# EAGLE schematic reflow-oven (EAGLE 9.6.2)
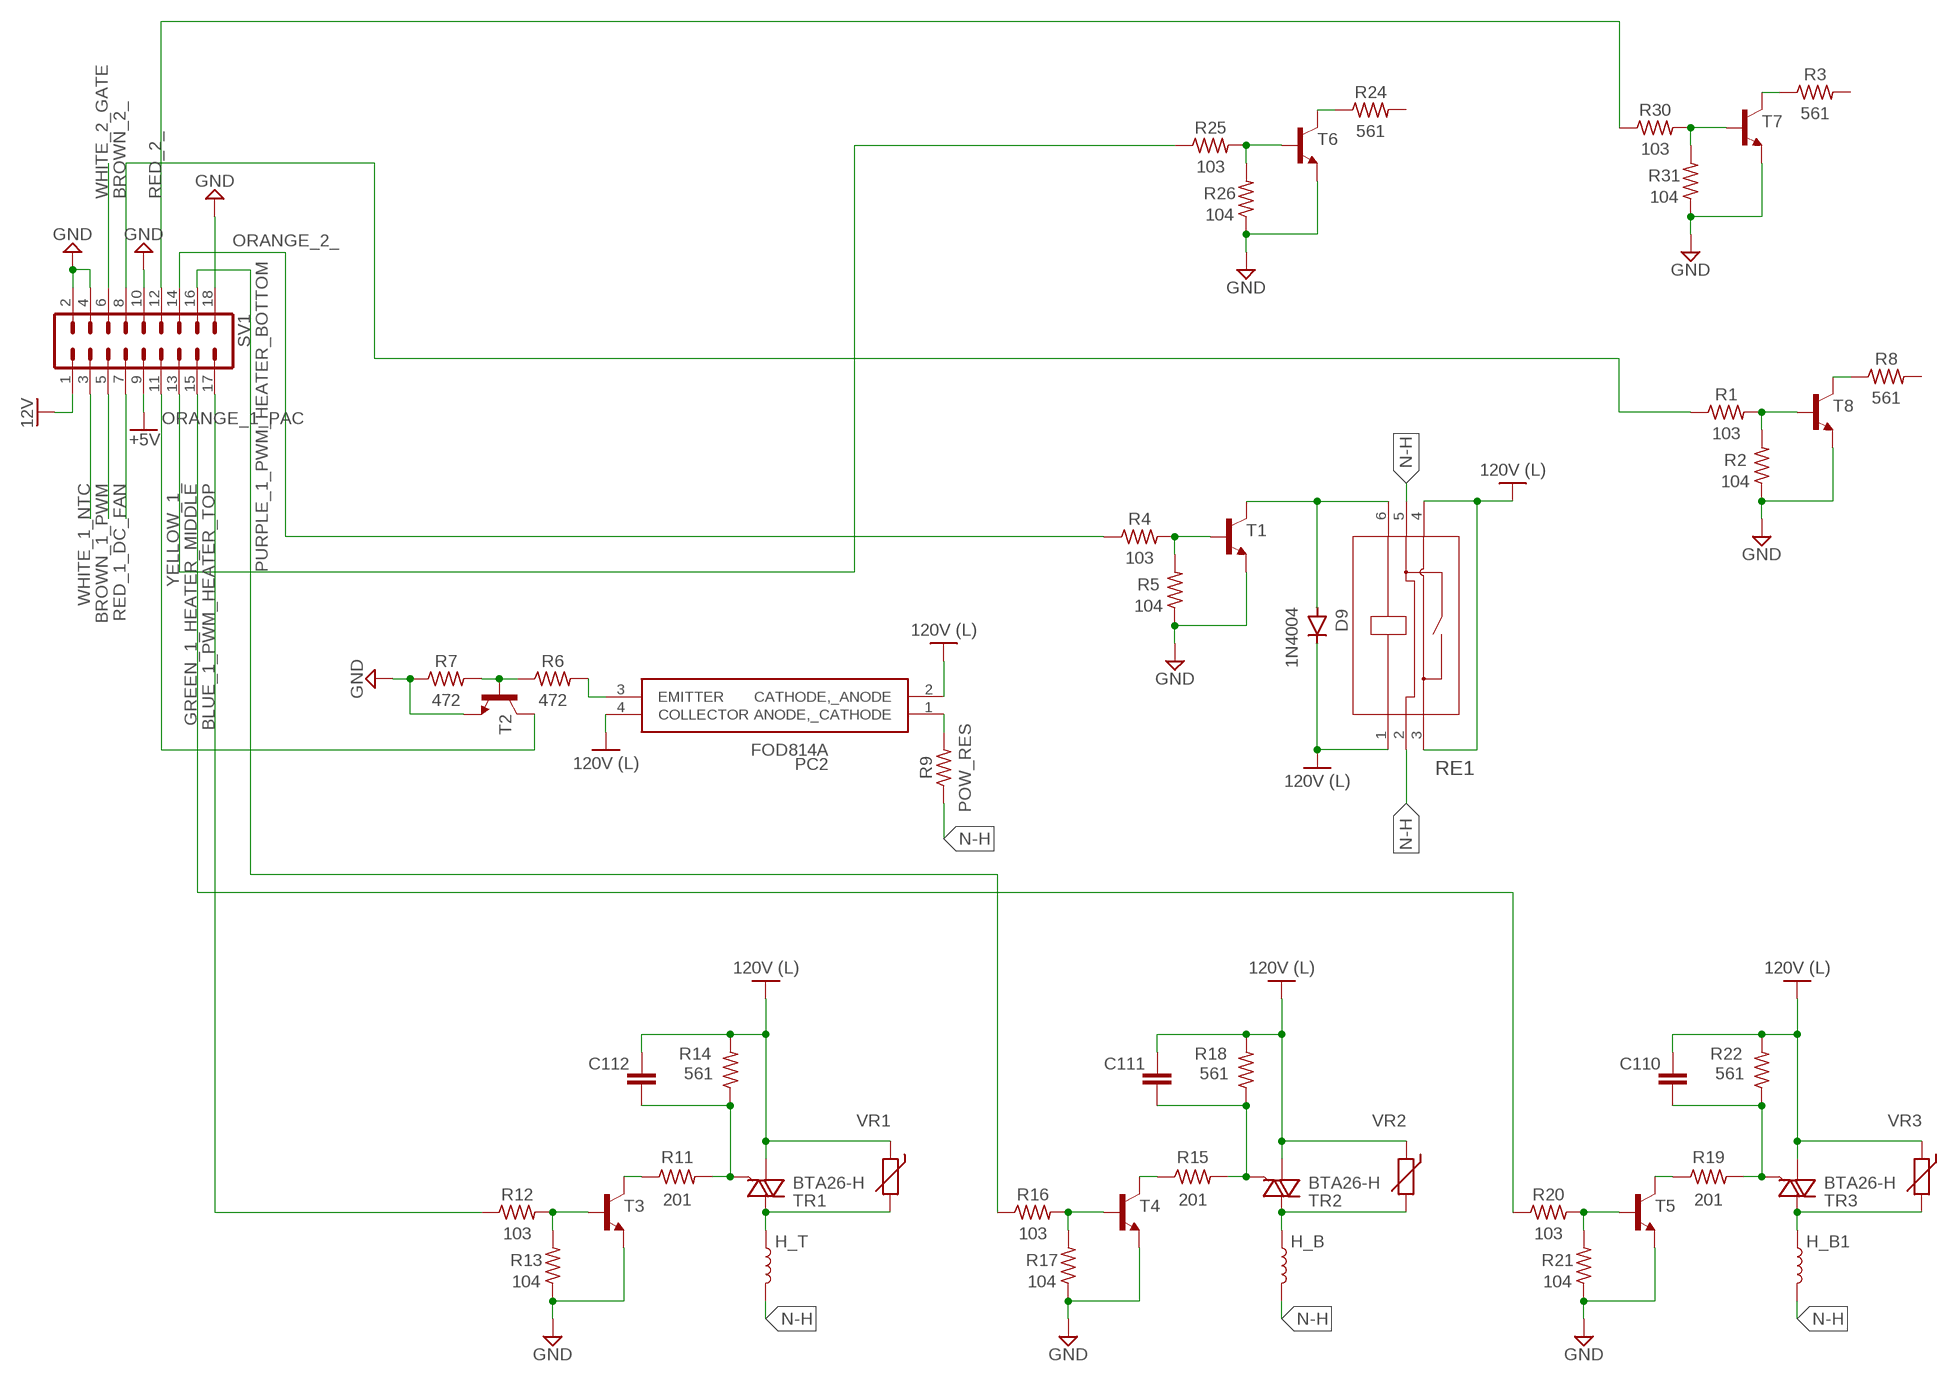
[diagram p0: schematic, sheet 1]

## Parts
C110  C_CHIP-1206(3216-METRIC)  [CAPC3216X135]
C111  C_CHIP-1206(3216-METRIC)  [CAPC3216X135]
C112  C_CHIP-1206(3216-METRIC)  [CAPC3216X135]
D9  1N4004  [DO-41]
H_B  3.9NH  INDUCTOR-0402-3.9NH  [0402]
H_B1  3.9NH  INDUCTOR-0402-3.9NH  [0402]
H_T  3.9NH  INDUCTOR-0402-3.9NH  [0402]
PC2  FOD814A  [DIP762W60P254L460H440Q4N]
R1  103  R-US_CHIP-1206(3216-METRIC)  [RESC3216X70]
R2  104  R-US_CHIP-1206(3216-METRIC)  [RESC3216X70]
R3  561  R-US_CHIP-1206(3216-METRIC)  [RESC3216X70]
R4  103  R-US_CHIP-1206(3216-METRIC)  [RESC3216X70]
R5  104  R-US_CHIP-1206(3216-METRIC)  [RESC3216X70]
R6  472  R-US_CHIP-1206(3216-METRIC)  [RESC3216X70]
R7  472  R-US_CHIP-1206(3216-METRIC)  [RESC3216X70]
R8  561  R-US_CHIP-1206(3216-METRIC)  [RESC3216X70]
R9  POW_RES  R-US_CHIP-1206(3216-METRIC)  [RESC3216X70]
R11  201  R-US_CHIP-1206(3216-METRIC)  [RESC3216X70]
R12  103  R-US_CHIP-1206(3216-METRIC)  [RESC3216X70]
R13  104  R-US_CHIP-1206(3216-METRIC)  [RESC3216X70]
R14  561  R-US_CHIP-1206(3216-METRIC)  [RESC3216X70]
R15  201  R-US_CHIP-1206(3216-METRIC)  [RESC3216X70]
R16  103  R-US_CHIP-1206(3216-METRIC)  [RESC3216X70]
R17  104  R-US_CHIP-1206(3216-METRIC)  [RESC3216X70]
R18  561  R-US_CHIP-1206(3216-METRIC)  [RESC3216X70]
R19  201  R-US_CHIP-1206(3216-METRIC)  [RESC3216X70]
R20  103  R-US_CHIP-1206(3216-METRIC)  [RESC3216X70]
R21  104  R-US_CHIP-1206(3216-METRIC)  [RESC3216X70]
R22  561  R-US_CHIP-1206(3216-METRIC)  [RESC3216X70]
R24  561  R-US_CHIP-1206(3216-METRIC)  [RESC3216X70]
R25  103  R-US_CHIP-1206(3216-METRIC)  [RESC3216X70]
R26  104  R-US_CHIP-1206(3216-METRIC)  [RESC3216X70]
R30  103  R-US_CHIP-1206(3216-METRIC)  [RESC3216X70]
R31  104  R-US_CHIP-1206(3216-METRIC)  [RESC3216X70]
RE1  HF115F/012-1HS3AF(257)HF115F-1H-3_HNG  [HF115F-1H-3_HNG]
SV1  MA09-2  [MA09-2]
T1  BC817-16LT1SMD  [SOT23-BEC]
T2  BC817-16LT1SMD  [SOT23-BEC]
T3  BC817-16LT1SMD  [SOT23-BEC]
T4  BC817-16LT1SMD  [SOT23-BEC]
T5  BC817-16LT1SMD  [SOT23-BEC]
T6  BC817-16LT1SMD  [SOT23-BEC]
T7  BC817-16LT1SMD  [SOT23-BEC]
T8  BC817-16LT1SMD  [SOT23-BEC]
TR1  BTA26-H  [TOP3L-1]
TR2  BTA26-H  [TOP3L-1]
TR3  BTA26-H  [TOP3L-1]
VR1  THERMISTOR-5  [R-5]
VR2  THERMISTOR-5  [R-5]
VR3  THERMISTOR-5  [R-5]

## Nets
12V: SV1.1
+5V: SV1.9
BLUE_1_PWM_HEATER_TOP: R12.1 SV1.17
BROWN_1_PWM: SV1.5
BROWN_2_: R1.1 SV1.8
GND: R2.1 R5.1 R7.1 R13.1 R17.1 R21.1 R26.1 R31.1 SV1.2 SV1.4 SV1.10 SV1.18 T1.E T2.E T3.E T4.E T5.E T6.E T7.E T8.E
GREEN_1_HEATER_MIDDLE: R20.1 SV1.15
N$1: R12.2 R13.2 T3.B
N$2: R20.2 R21.2 T5.B
N$3: R11.1 T3.C
N$4: H_T.1 TR1.A2 VR1.2
N$5: C112.2 R11.2 R14.1 TR1.G
N$6: R19.1 T5.C
N$7: R16.2 R17.2 T4.B
N$8: R15.1 T4.C
N$9: H_B.1 TR2.A2 VR2.2
N$10: C111.2 R15.2 R18.1 TR2.G
N$11: H_B1.1 TR3.A2 VR3.2
N$12: C110.2 R19.2 R22.1 TR3.G
N$13: PC2.1(ANODE,_CATHODE) R9.2
N$14: R25.2 R26.2 T6.B
N$15: R6.1 R7.2 T2.B
N$16: PC2.3(EMITTER) R6.2
N$17: R4.2 R5.2 T1.B
N$18: D9.A RE1.6 T1.C
N$19: R24.1 T6.C
N$20: R30.2 R31.2 T7.B
N$21: R3.1 T7.C
N$22: R1.2 R2.2 T8.B
N$23: R8.1 T8.C
N-H: H_B1.2 H_B.2 H_T.2 R9.1 RE1.2 RE1.5
ORANGE_1_PAC: SV1.11 T2.C
ORANGE_2_: R4.1 SV1.14
PURPLE_1_PWM_HEATER_BOTTOM: R16.1 SV1.16
RED_1_DC_FAN: SV1.7
RED_2_: R30.1 SV1.12
VSS: D9.C PC2.4(COLLECTOR) RE1.1 RE1.3 RE1.4 ; supply symbol labelled 120V (L)
WHITE_1_NTC: SV1.3
WHITE_2_GATE: SV1.6
YELLOW_1_: R25.1 SV1.13
~120V(L): C110.1 C111.1 C112.1 PC2.2(CATHODE,_ANODE) R14.2 R18.2 R22.2 TR1.A1 TR2.A1 TR3.A1 VR1.1 VR2.1 VR3.1 ; supply symbol labelled 120V (L)
Unconnected: R3.2 R8.2 R24.2

## Library data of the parts
C110-C112 = Capacitor:C: Capacitor - Generic; CATEGORY: Capacitor
D9 = Diodes:1N4004: DIODE GEN PURP 400V 1A DO41 Manufacturer's datasheet <https://www.mccsemi.com/pdf/Products/1N4001-1N4007(DO-41).pdf>; CREATED_BY: PCBLayout.com; DIGIKEY_PART_NUMBER: 1N4004MSCT-ND; MANUFACTURER: Micro Commercial Co; MPN: 1N4004; PACKAGE: DO-41
H_B H_B1 H_T = SparkFun-Coils:INDUCTOR: Inductors Resist changes in electrical current. Basically a coil of wire. SparkFun Products: SparkFun Load Cell Amplifier - HX711 <https://www.sparkfun.com/products/13879> IOIO-OTG - V2.2 <https://www.sparkfun.com/products/13613>; PROD_ID: NDUC-13457
PC2 = FOD814A:FOD814A: Optocoupler Transistor AC-in 50-150% DIP Source: Datasheet <https://eu.mouser.com/datasheet/2/308/FOD814A-1300759.pdf>; ARROW_PART_NUMBER: FOD814A; ARROW_PRICE-STOCK: https://www.arrow.com/en/products/fod814a/on-semiconductor; DESCRIPTION: Optocoupler Transistor AC-in 50-150% DIP; HEIGHT: 4.4mm; MANUFACTURER_NAME: onsemi; MANUFACTURER_PART_NUMBER: FOD814A; MOUSER_PART_NUMBER: 512-FOD814A; MOUSER_PRICE-STOCK: https://www.mouser.co.uk/ProductDetail/ON-Semiconductor-Fairchild/FOD814A?qs=%252BPJ3Ll1xQNbDn8EmaM1tIw%3D%3D
R1-R9 R11-R22 R24-R26 R30 R31 = Resistor:R-US: Resistor Fixed - ANSI; CATEGORY: Resistor; SUB-CATEGORY: Fixed
RE1 = HF115F-1H-3_HNG:HF115F/012-1HS3AF(257); COPYRIGHT: Copyright (C) 2022 Ultra Librarian. All rights reserved.; MANUFACTURER_PART_NUMBER: HF115F/012-1HS3AF(257); MFR_NAME: Hongfa
SV1 = con-lstb:MA09-2: PIN HEADER; OC_FARNELL: unknown; OC_NEWARK: unknown
T1-T8 = transistor-npn:BC817*: NPN Transistor
TR1-TR3 = triac:BTA26: 25A TRIAC Source: http://www.st.com/stonline/products/literature/ds/7470.pdf
VR1-VR3 = varistor:THERMISTOR: THERMISTOR